# Altium schematic sheet MCU_MKE185F512VLH16.SchDoc: Microcontroller
size A4; DrawnBy: Alvin Ha; DocumentNumber: MCU2018-2; Revision: 2.0; SheetNumber: 2; SheetTotal: 4
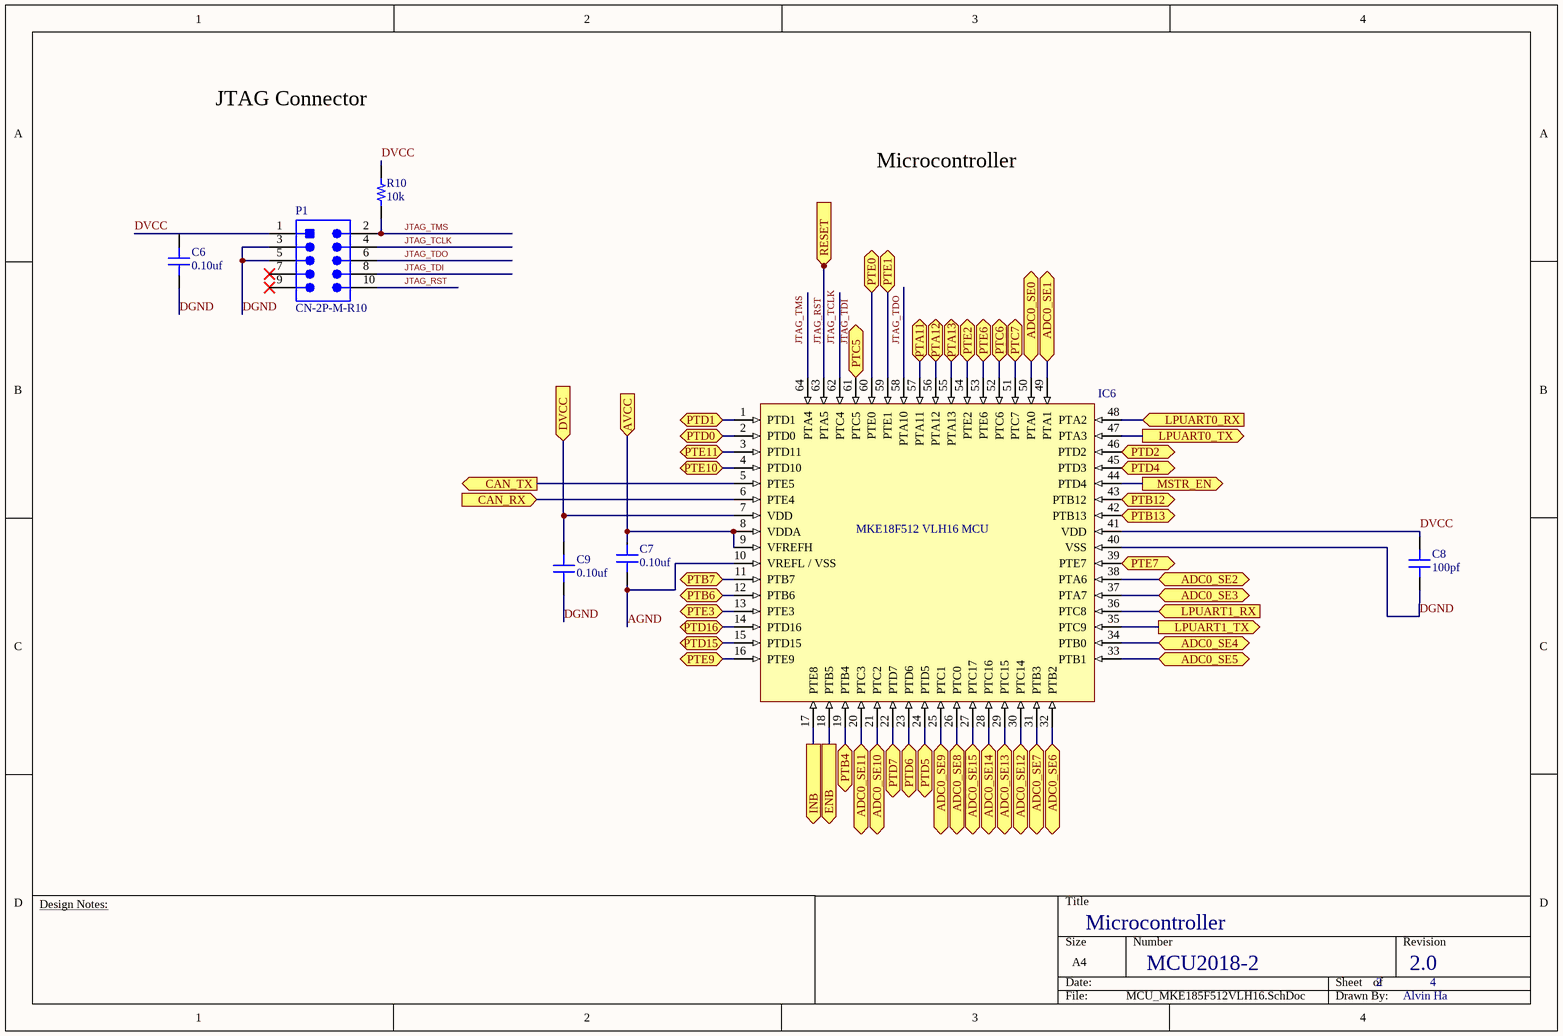
[diagram p0: MCU_MKE185F512VLH16.SchDoc]

## Parts
C6  value 0.10uf  [CAP 0603/1608]  (hidden comment: Capacitor MLCC 0.10uf 16V CAP 0603/1608)
C7  value 0.10uf  [CAP 0603/1608]  (hidden comment: Capacitor MLCC 0.10uf 25V CAP 0603/1608)
C8  value 100pf  [CAP 0603/1608]  (hidden comment: Capacitor MLCC 100pf 25V CAP 0603/1608)
C9  value 0.10uf  [CAP 0603/1608]  (hidden comment: Capacitor MLCC 0.10uf 25V CAP 0603/1608)
IC6  MKE18F512 VLH16 MCU  [TQFP64]
P1  CN-2P-M-R10  [HDR2X5_SMT]
R10  value 10k  [RES 0603/1608]  (hidden comment: Resistor 10k 0603 1/10W 1%)

## Ports
ADC0_SE0 (bidir), ADC0_SE1 (bidir), ADC0_SE2 (bidir), ADC0_SE3 (bidir), ADC0_SE4 (bidir), ADC0_SE5 (bidir), ADC0_SE6 (bidir), ADC0_SE7 (bidir), ADC0_SE8 (bidir), ADC0_SE9 (bidir), ADC0_SE10 (bidir), ADC0_SE11 (bidir), ADC0_SE12 (bidir), ADC0_SE13 (bidir), ADC0_SE14 (bidir), ADC0_SE15 (bidir), AVCC (in), CAN_RX (in), CAN_TX (out), DVCC (in), ENB (out), INB (out), LPUART0_RX (in), LPUART0_TX (out), LPUART1_RX (in), LPUART1_TX (out), MSTR_EN (out), PTA11 (bidir), PTA12 (bidir), PTA13 (bidir), PTB4 (bidir), PTB6 (bidir), PTB7 (bidir), PTB12 (bidir), PTB13 (bidir), PTC5 (bidir), PTC6 (bidir), PTC7 (bidir), PTD0 (bidir), PTD1 (bidir), PTD2 (bidir), PTD4 (bidir), PTD5 (bidir), PTD6 (bidir), PTD7 (bidir), PTD15 (bidir), PTD16 (bidir), PTE0 (bidir), PTE1 (bidir), PTE2 (bidir), PTE3 (bidir), PTE6 (bidir), PTE7 (bidir), PTE9 (bidir), PTE10 (bidir), PTE11 (bidir), RESET (in)

## Nets
ADC0_SE0: IC6.50(PTA0) ; port ADC0_SE0
ADC0_SE1: IC6.49(PTA1) ; port ADC0_SE1
ADC0_SE2: IC6.38(PTA6) ; port ADC0_SE2
ADC0_SE3: IC6.37(PTA7) ; port ADC0_SE3
ADC0_SE4: IC6.34(PTB0) ; port ADC0_SE4
ADC0_SE5: IC6.33(PTB1) ; port ADC0_SE5
ADC0_SE6: IC6.32(PTB2) ; port ADC0_SE6
ADC0_SE7: IC6.31(PTB3) ; port ADC0_SE7
ADC0_SE8: IC6.26(PTC0) ; port ADC0_SE8
ADC0_SE9: IC6.25(PTC1) ; port ADC0_SE9
ADC0_SE10: IC6.21(PTC2) ; port ADC0_SE10
ADC0_SE11: IC6.20(PTC3) ; port ADC0_SE11
ADC0_SE12: IC6.30(PTC14) ; port ADC0_SE12
ADC0_SE13: IC6.29(PTC15) ; port ADC0_SE13
ADC0_SE14: IC6.28(PTC16) ; port ADC0_SE14
ADC0_SE15: IC6.27(PTC17) ; port ADC0_SE15
AGND: C7.1 IC6.10(VREFL_/_VSS)
AVCC: C7.2 IC6.8(VDDA) IC6.9(VFREFH) ; port AVCC
CAN_RX: IC6.6(PTE4) ; port CAN_RX
CAN_TX: IC6.5(PTE5) ; port CAN_TX
DGND: C6.1 C8.1 C9.1 IC6.40(VSS) P1.3 P1.5
DVCC: C9.2 IC6.7(VDD) ; port DVCC
DVCC: C8.2 IC6.41(VDD) P1.1 R10.2  [a separate net that carries the same name]
ENB: IC6.18(PTB5) ; port ENB
INB: IC6.17(PTE8) ; port INB
JTAG_RST: IC6.63(PTA5) P1.10 ; port RESET
JTAG_TCLK: P1.4
JTAG_TDI: P1.8
JTAG_TDO: P1.6
JTAG_TMS: P1.2 R10.1
LPUART0_RX: IC6.48(PTA2) ; port LPUART0_RX
LPUART0_TX: IC6.47(PTA3) ; port LPUART0_TX
LPUART1_RX: IC6.36(PTC8) ; port LPUART1_RX
LPUART1_TX: IC6.35(PTC9) ; port LPUART1_TX
MSTR_EN: IC6.44(PTD4) ; port MSTR_EN
PTA11: IC6.57(PTA11) ; port PTA11
PTA12: IC6.56(PTA12) ; port PTA12
PTA13: IC6.55(PTA13) ; port PTA13
PTB4: IC6.19(PTB4) ; port PTB4
PTB6: IC6.12(PTB6) ; port PTB6
PTB7: IC6.11(PTB7) ; port PTB7
PTB12: IC6.43(PTB12) ; port PTB12
PTB13: IC6.42(PTB13) ; port PTB13
PTC5: IC6.61(PTC5) ; port PTC5
PTC6: IC6.52(PTC6) ; port PTC6
PTC7: IC6.51(PTC7) ; port PTC7
PTD0: IC6.2(PTD0) ; port PTD0
PTD1: IC6.1(PTD1) ; port PTD1
PTD2: IC6.46(PTD2) ; port PTD2
PTD4: IC6.45(PTD3) ; port PTD4
PTD5: IC6.24(PTD5) ; port PTD5
PTD6: IC6.23(PTD6) ; port PTD6
PTD7: IC6.22(PTD7) ; port PTD7
PTD15: IC6.15(PTD15) ; port PTD15
PTD16: IC6.14(PTD16) ; port PTD16
PTE0: IC6.60(PTE0) ; port PTE0
PTE1: IC6.59(PTE1) ; port PTE1
PTE2: IC6.54(PTE2) ; port PTE2
PTE3: IC6.13(PTE3) ; port PTE3
PTE6: IC6.53(PTE6) ; port PTE6
PTE7: IC6.39(PTE7) ; port PTE7
PTE9: IC6.16(PTE9) ; port PTE9
PTE10: IC6.4(PTD10) ; port PTE10
PTE11: IC6.3(PTD11) ; port PTE11

Not connected (* = marked no-connect by the designer): C6 2; IC6 58(PTA10) 62(PTC4) 64(PTA4); P1 7* 9*

## Notes on the sheet
- JTAG Connector
- Microcontroller
- Design Notes:
- Labels drawn without touching a wire or pin: JTAG_TCLK, JTAG_TDI, JTAG_TDO, JTAG_TMS

## Library data of the parts
C6 = 223: Manufacturer_id: 1; idCapacitor: 223; Name: Cap_0.10uf_16V_CAP 0603/1608; Dielectric: Ceramic; Created_By: Nick Mah; Drawer_id: 1; Voltage_Rating: 16V; Package: CAP 0603/1608; Created_Date: 10/20/2018
C7 C9 = 583: Manufacturer_id: 1; idCapacitor: 583; Name: Cap_0.10uf_25V_CAP 0603/1608; Dielectric: Ceramic; Created_By: Nick Mah; Drawer_id: 1; Voltage_Rating: 25V; Package: CAP 0603/1608; Created_Date: 10/20/2018
C8 = 529: Manufacturer_id: 1; idCapacitor: 529; Name: Cap_100pf_25V_CAP 0603/1608; Dielectric: Ceramic; Created_By: Nick Mah; Drawer_id: 1; Voltage_Rating: 25V; Package: CAP 0603/1608; Created_Date: 10/20/2018
IC6 = 1: idMCU: 1; Manufacturer_id: 1; Drawer_id: 1; Name: MKE18F512VLH16 MCU
P1 = 4: 2 row connector; Manufacturer_id: 1; MfrPartNo: 5103309-1; idConn: 4; Name: CONN_TE_2X5POS; Value: CONN; Voltage_Rating: None; Num_Contacts: 10; Num_Rows: 2; Pitch: 2.54mm; Created_By: Aiku; Drawer_id: 1; Link: https://www.digikey.com/product-detail/en/5103309-1/A33160-ND/1114898?utm_campaign=buynow&WT.z_cid=ref_octopart_dkc_buynow&utm_medium=aggregator&curr=usd&site=us&utm_source=octopart; ComponentLink1Description: Datasheet
R10 = 313: Manufacturer_id: 1; idResistor: 313; Name: Res_10k_0603_1/10W_1%; Created_By: Nick Mah; Supplier 1: Digi-Key; Drawer_id: 1; Tolerance: 1%; Power: 1/10W; Package: 0603; ComponentLink1Description: Datasheet; Created_Date: 2018-10-20